# EAGLE design LTC2473CDR1 (EAGLE 9.6.2)
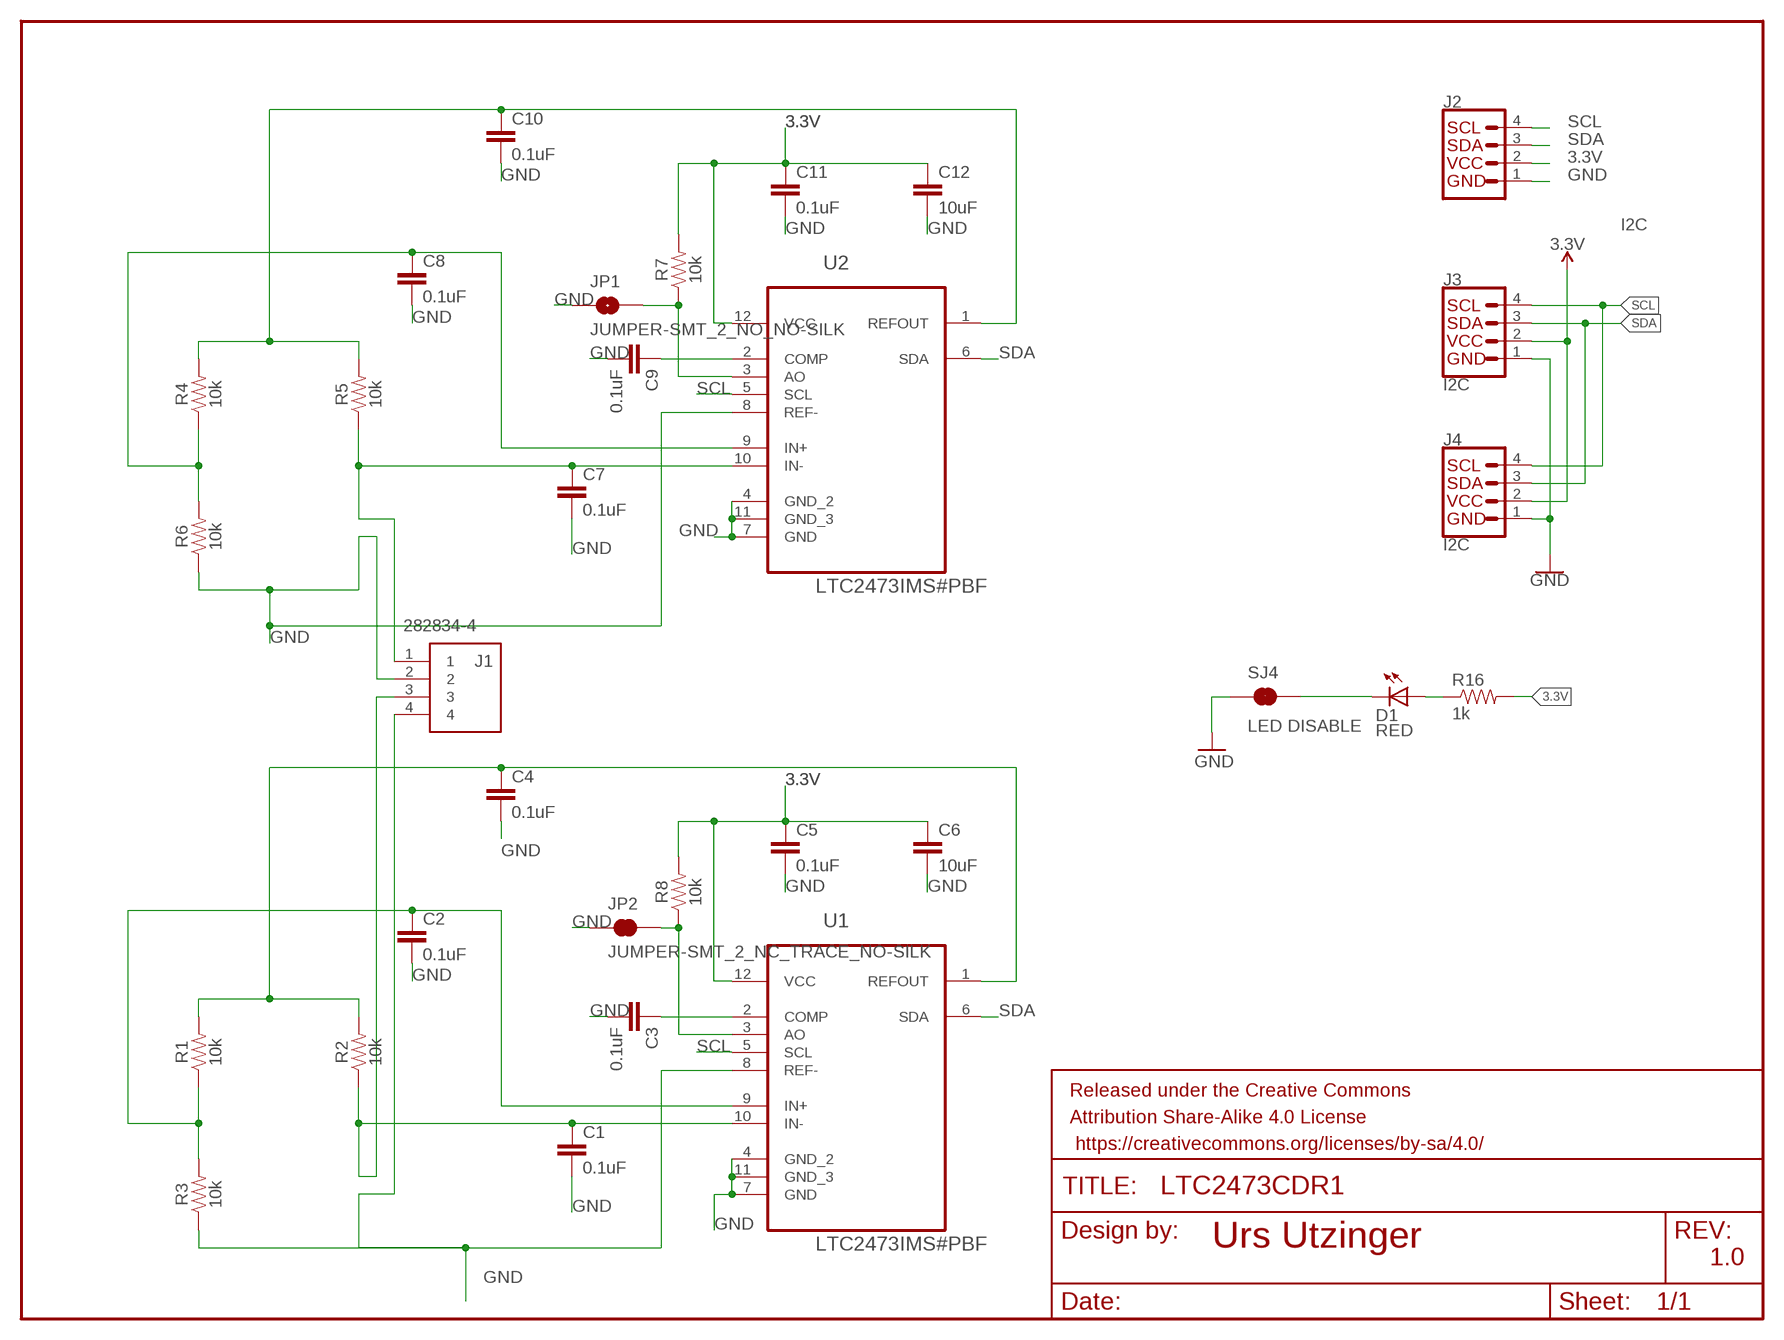
[diagram p0: schematic, sheet 1]

## Parts
C1  0.1uF  0.1UF-0603-25V-(+80/-20%)  [0603]
C2  0.1uF  0.1UF-0603-25V-(+80/-20%)  [0603]
C3  0.1uF  0.1UF-0603-25V-(+80/-20%)  [0603]
C4  0.1uF  0.1UF-0603-25V-(+80/-20%)  [0603]
C5  0.1uF  0.1UF-0603-25V-(+80/-20%)  [0603]
C6  10uF  10UF-0603-6.3V-20%  [0603]
C7  0.1uF  0.1UF-0603-25V-(+80/-20%)  [0603]
C8  0.1uF  0.1UF-0603-25V-(+80/-20%)  [0603]
C9  0.1uF  0.1UF-0603-25V-(+80/-20%)  [0603]
C10  0.1uF  0.1UF-0603-25V-(+80/-20%)  [0603]
C11  0.1uF  0.1UF-0603-25V-(+80/-20%)  [0603]
C12  10uF  10UF-0603-6.3V-20%  [0603]
D1  RED  LED-RED0603  [LED-0603]
FRAME1  FRAME-LETTERNO_PACKAGE  [DUMMY]
J1  282834-4  [2828344]
J2  I2C  I2C_STANDARD  [1X04]
J3  I2C  QWIIC_CONNECTORJS-1MM  [JST04_1MM_RA]
J4  I2C  QWIIC_CONNECTORJS-1MM  [JST04_1MM_RA]
JP1  JUMPER-SMT_2_NO_NO-SILK  [SMT-JUMPER_2_NO_NO-SILK]
JP2  JUMPER-SMT_2_NC_TRACE_NO-SILK  [SMT-JUMPER_2_NC_TRACE_NO-SILK]
R1  10k  10KOHM-0603-1/10W-1%  [0603]
R2  10k  10KOHM-0603-1/10W-1%  [0603]
R3  10k  10KOHM-0603-1/10W-1%  [0603]
R4  10k  10KOHM-0603-1/10W-1%  [0603]
R5  10k  10KOHM-0603-1/10W-1%  [0603]
R6  10k  10KOHM-0603-1/10W-1%  [0603]
R7  10k  10KOHM-0603-1/10W-1%  [0603]
R8  10k  10KOHM-0603-1/10W-1%  [0603]
R16  1k  1KOHM-0603-1/10W-1%  [0603]
SJ4  LED DISABLE  JUMPER-SMT_2_NC_TRACE_NO-SILK  [SMT-JUMPER_2_NC_TRACE_NO-SILK]
U1  LTC2473IMS#PBF  [SOP65P490X110-12N]
U2  LTC2473IMS#PBF  [SOP65P490X110-12N]

## Nets
3.3V: C5.1 C6.1 C11.1 C12.1 J2.2 J3.2 J4.2 R7.2 R8.2 R16.2 U1.12(VCC) U2.12(VCC)
GND: C1.2 C2.2 C3.2 C4.2 C5.2 C6.2 C7.2 C8.2 C9.2 C10.2 C11.2 C12.2 J1.2 J1.4 J2.1 J3.1 J4.1 JP1.1 JP2.1 R3.1 R6.1 SJ4.1 U1.4(GND_2) U1.7(GND) U1.8(REF-) U1.11(GND_3) U2.4(GND_2) U2.7(GND) U2.8(REF-) U2.11(GND_3)
N$1: C3.1 U1.2(COMP)
N$2: C2.1 R1.1 R3.2 U1.9(IN+)
N$3: C8.1 R4.1 R6.2 U2.9(IN+)
N$4: C4.1 R1.2 R2.2 U1.1(REFOUT)
N$5: JP1.2 R7.1 U2.3(AO)
N$6: D1.A R16.1
N$8: C7.1 J1.1 R5.1 U2.10(IN-)
N$9: C10.1 R4.2 R5.2 U2.1(REFOUT)
N$10: D1.C SJ4.2
N$11: C9.1 U2.2(COMP)
N$12: C1.1 J1.3 R2.1 U1.10(IN-)
N$13: JP2.2 R8.1 U1.3(AO)
SCL: J2.4 J3.4 J4.4 U1.5(SCL) U2.5(SCL)
SDA: J2.3 J3.3 J4.3 U1.6(SDA) U2.6(SDA)

## Notes on the sheet
- Urs Utzinger
- 1.0

## Library data of the parts
C1-C5 C7-C11 = SparkFun-Capacitors:0.1UF: 0.1µF ceramic capacitors A capacitor is a passive two-terminal electrical component used to store electrical energy temporarily in an electric field.; PROD_ID: CAP-00810
C6 C12 = SparkFun-Capacitors:10UF: 10.0µF ceramic capacitors A capacitor is a passive two-terminal electrical component used to store electrical energy temporarily in an electric field.; PROD_ID: CAP-11015
D1 = SparkFun-LED:LED-RED: Assorted Red LEDs LilyPad 1206- DIO-09912 1206- DIO-00809 0603- DIO-00819; PROD_ID: DIO-00819
FRAME1 = SparkFun-Aesthetics:FRAME-LETTER: Schematic Frame - Letter Standard 8.5x11 US Letter frame; DESIGNER: Nobody; VERSION: v01
J1 = SamacSys_Parts:282834-4: ic Source: Datasheet <https://www.te.com/commerce/DocumentDelivery/DDEController?Action=srchrtrv&DocNm=282834&DocType=Customer Drawing&DocLang=English&PartCntxt=282834-4&DocFormat=pdf>; DESCRIPTION: ic; HEIGHT: 10.3mm; MANUFACTURER_NAME: TE Connectivity; MANUFACTURER_PART_NUMBER: 282834-4; MOUSER_PART_NUMBER: 571-282834-4; MOUSER_PRICE-STOCK: https://www.mouser.co.uk/ProductDetail/TE-Connectivity/282834-4?qs=A%252Bip%252BNCYi6Pqom9P%2FaHyRQ%3D%3D
J2 = SparkFun-Connectors:I2C_STANDARD: SparkFun I2C Standard Pinout Header SparkFun has standardized on a pinout for all I2C based sensor breakouts. This pinout allows I2C boards to be plugged directly into the headers on Arduino Uno compatible boards, and to be daisy chained easily. Example SparkFun Products: SparkFun Atmospheric Sensor Breakout - BME280 <https://www.sparkfun.com/products/13676> SparkFun Altitude/Pressure Sensor Breakout - MPL3115A2 <https://www.sparkfun.com/products/11084> SparkFun TOF Range Finder Sensor - VL6180 <https://www.sparkfun.com/products/12785>
J3 J4 = SparkFun-Connectors:QWIIC_CONNECTOR: SparkFun I2C Standard Qwiic Connector An SMD 1mm pitch JST connector makes it easy and quick (get it? Qwiic?) to connect I2C devices to each other. The Qwiic system <http://www.sparkfun.com/qwiic> enables fast and solderless connection between popular platforms and various sensors and actuators. We carry 200mm <https://www.sparkfun.com/products/14204>, 100mm <https://www.sparkfun.com/products/14205>, 50mm <https://www.sparkfun.com/products/14206>, and breadboard friendly <https://www.sparkfun.com/products/14207> Qwiic cables. We also offer 10 pcs strips <https://www.sparkfun.com/products/14323> the SMD connectors.; PROD_ID: CONN-13694
JP1 = SparkFun-Jumpers:JUMPER-SMT_2_NO: Normally open jumper This jumper has two pads in close proximity to each other. Apply solder to close the connection. Round pads are easier to solder for beginners, but are a lot larger. SparkFun Product that uses the round pads: SparkFun EL Sequencer <https://www.sparkfun.com/products/12781>
JP2 SJ4 = SparkFun-Jumpers:JUMPER-SMT_2_NC_TRACE: Normally closed trace jumper This jumper has a trace between two pads so it's normally closed (NC). Use a razor knife to open the connection. For best results follow the IPC guidelines for cutting traces: Cutout at least 0.063 mm (0.005 in). Remove all loose material to clean up the cut area. Seal the cut with an approved epoxy. Reapply solder to reclose the connection.
R1-R8 = SparkFun-Resistors:10KOHM: 10kΩ resistor A resistor is a passive two-terminal electrical component that implements electrical resistance as a circuit element. Resistors act to reduce current flow, and, at the same time, act to lower voltage levels within circuits. - Wikipedia; PROD_ID: RES-00824
R16 = SparkFun-Resistors:1KOHM: 1kΩ resistor A resistor is a passive two-terminal electrical component that implements electrical resistance as a circuit element. Resistors act to reduce current flow, and, at the same time, act to lower voltage levels within circuits. - Wikipedia; PROD_ID: RES-07856
U1 U2 = LTC2473IMS_PBF:LTC2473IMS#PBF: ADC Check availability <https://pricing.snapeda.com/parts/LTC2473IMS%23PBF/Analog%20Devices/view-part?ref=eda>; AVAILABILITY: In Stock; DESCRIPTION: Selectable 208sps/833sps, 16-Bit I2C ΔΣ ADCs with 10ppm/°C Max Precision Reference; MF: Analog Devices; MP: LTC2473IMS#PBF; PACKAGE: MSOP-12 Analog Devices; PRICE: None; PURCHASE-URL: https://pricing.snapeda.com/search/part/LTC2473IMS#PBF/?ref=eda

## Net classes
0 default: clearance 0.205 mm

## Board
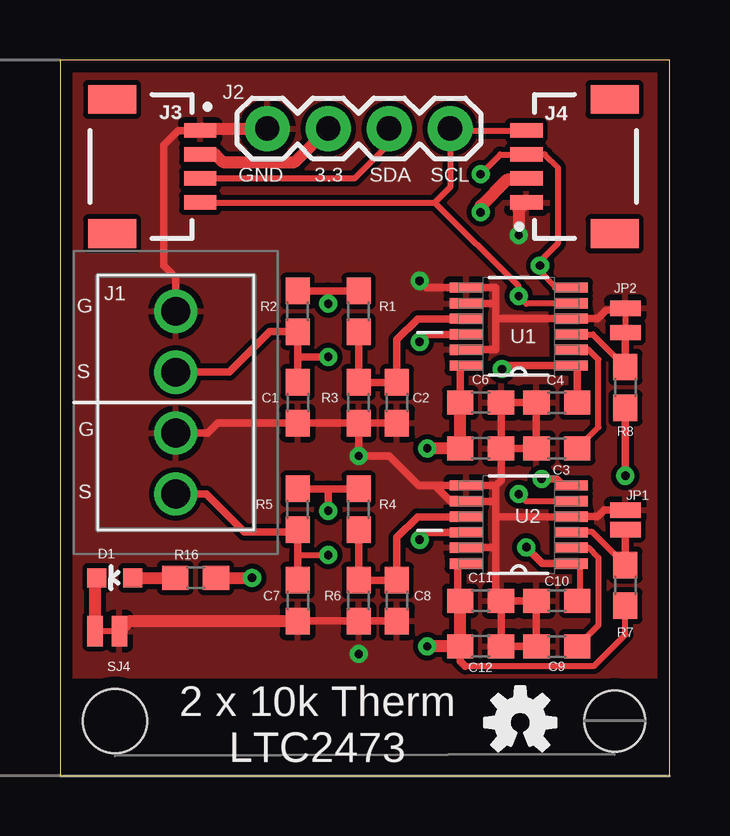
[diagram p1: board, top side]
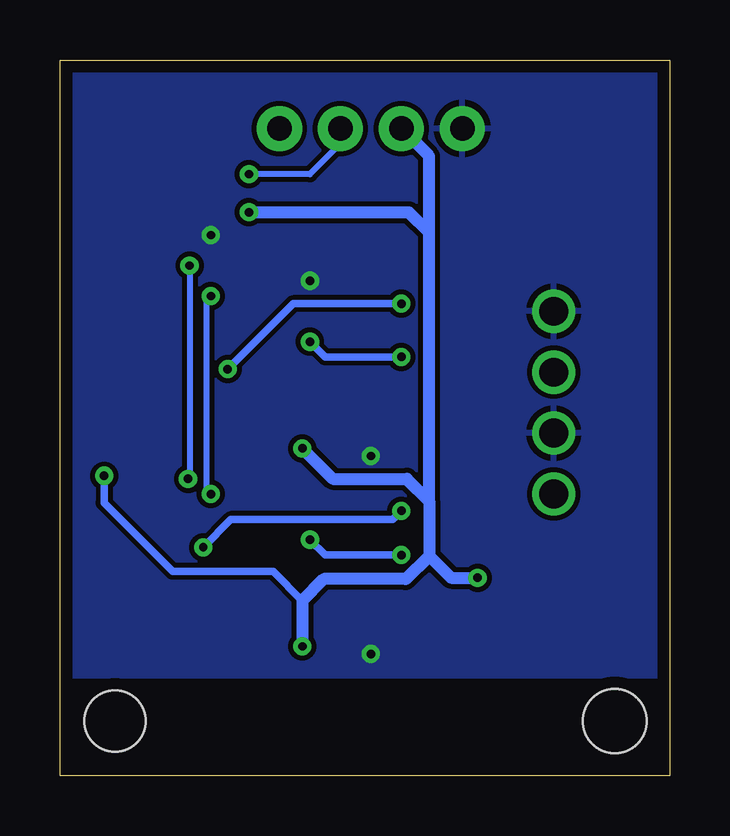
[diagram p2: board, bottom side, seen from below]

Size 25.4 x 29.84 mm. Coordinates in mm from the lower left corner, seen from the top.
Outline: 0,0 25.4,0 25.4,29.84 0,29.84 0,0
Copper layers (1*16): Top 0.035mm / dielectric 1.5mm / Bottom 0.035mm
Design rules "default *": minimum track width 6mil, minimum drill 0.35mm, track to track 6mil, track to pad 6mil, pad to pad 6mil, via to via 6mil, smd to smd 6mil, copper to edge 20mil, drill to drill 6mil, minimum pad ring 10mil, minimum via ring 8mil, stop-mask expansion 4mil, vias tented up to drill 0mil, thermal gap 10mil
Holes 2.67 mm at 2.29,2.29
Holes 2.54 mm at 23.11,2.29

### Footprints (pad centres in the part's own frame; a part is rotated, then mirrored left to right if it is on the bottom)
0603 = smd 1.1 x 1: 1 -0.85,0; 2 0.85,0
LED-0603 = smd 0.8 x 0.8: A 0,-0.75; C 0,0.75
2828344 = drill 1.2 pad 1.8: 1 0,0; 2 2.54,0; 3 5.08,0; 4 7.62,0
1X04 = drill 1.016 pad 1.88: 1 0,0; 2 2.54,0; 3 5.08,0; 4 7.62,0
JST04_1MM_RA = smd 0.6 x 1.35: 1 -1.5,0; 2 -0.5,0; 3 0.5,0; 4 1.5,0 | smd 1.2 x 2: NC1 2.8,-3.675; NC2 -2.8,-3.675
SMT-JUMPER_2_NO_NO-SILK = smd 0.635 x 1.27: 1 -0.406,0; 2 0.406,0
SMT-JUMPER_2_NC_TRACE_NO-SILK = smd 0.635 x 1.27: 1 -0.508,0; 2 0.508,0
SOP65P490X110-12N = smd 1.397 x 0.432: 1 -2.184,1.626; 2 -2.184,0.965; 3 -2.184,0.33; 4 -2.184,-0.33; 5 -2.184,-0.965; 6 -2.184,-1.626; 7 2.184,-1.626; 8 2.184,-0.965; 9 2.184,-0.33; 10 2.184,0.33; 11 2.184,0.965; 12 2.184,1.626

### Placement (x,y rotation side)
C1  9.91,15.56 270 top
C2  14.03,15.56 270 top
C3  20.7,13.65 180 top
C4  20.7,15.56 180 top
C5  17.53,13.65 0 top
C6  17.53,15.56 0 top
C7  9.91,7.3 270 top
C8  14.03,7.3 270 top
C9  20.7,5.4 180 top
C10  20.7,7.3 180 top
C11  17.53,7.3 0 top
C12  17.53,5.4 0 top
D1  2.29,8.26 90 top
FRAME1  -1.02,-0.51 0 top
J1  4.83,11.75 90 top
J2  8.64,26.99 0 top
J3  5.84,25.4 270 top
J4  19.43,25.4 90 top
JP1  23.56,10.67 270 top
JP2  23.56,18.99 270 top
R1  12.45,19.37 90 top
R2  9.91,19.37 90 top
R3  12.45,15.56 90 top
R4  12.45,11.11 90 top
R5  9.91,11.11 90 top
R6  12.45,7.3 90 top
R7  23.56,7.94 270 top
R8  23.56,16.19 270 top
R16  5.65,8.26 0 top
SJ4  1.97,6.03 180 top
U1  19.11,18.73 180 top
U2  19.11,10.48 180 top
U$1  [OSHW-LOGO-S]  19.18,2.22 0 top

### Tracks (layer width: path | path; a pad name or v marks a point on that pad's centre or on a via)
3.3V  (via drill 0.35)
  Top 0.254: R7.2 23.56,5.88 22.24,4.57 16.89,4.57 | J4.2 19.38,24.85 | U2.12 16.57,8.85
  Top 0.305: U1.12 16.68,17.11 C6.1 | R8.2 v23.56,12.51 | C11.1 16.57,7.3 16.57,8.85 | 16.89,4.57 16.68,4.78 C12.1
  Top 0.508: C6.1 C5.1 v15.3,13.65 | v15.3,5.4 C12.1 C11.1 | R16.2 v8,8.26 | J3.2 6.47,25.9 6.79,25.59 9.78,25.59 J2.2 | 19.38,24.85 18.62,24.85 17.53,23.76 v17.53,23.5
  Bottom 0.305: 15.3,7.3 16.52,8.52 20.7,8.52 23.56,11.38 v23.56,12.51
  Bottom 0.508: v15.3,13.65 14.03,12.38 10.95,12.38 10.02,11.46 | 10.02,11.46 10.02,9.18 | 10.02,9.18 10.99,8.21 14.4,8.21 15.3,7.3 v15.3,5.4 | 10.02,9.18 9.1,8.26 v8,8.26 | 10.02,11.46 10.02,22.66 | 10.02,22.66 10.86,23.5 v17.53,23.5 | 10.02,22.66 10.02,25.83 J2.2
GND  (via drill 0.35)
  Top 0.152: 19.9,14.04 19.85,14.02 C3.2 | 12.74,14.64 R3.1 | J3.1 5.93,26.99
  Top 0.254: 19.85,5.71 19.85,5.29 | 18.48,5.4 C12.2
  Top 0.305: R3.1 C1.2 6.58,14.71 6.16,14.29 J1.2 | R3.1 C2.2 | R3.1 v12.45,13.34 13.72,13.34 14.95,12.1 15.62,12.1 | U1.8 16.93,19.68 18.16,19.68 | 18.16,19.68 18.16,19.06 | U1.11 18.16,17.77 18.16,19.06 | 18.16,19.68 18.16,20.36 U1.7 15.27,20.36 v14.99,20.64 | C5.2 C6.2 C4.2 C3.2 C5.2 | 18.16,12.1 U2.7 15.62,12.1 | 18.16,12.1 18.16,11.43 | U2.11 18.16,9.51 | C8.2 R6.1 C7.2 | C11.2 C12.2 C9.2 | C11.2 C10.2 19.85,5.71 | 18.16,11.43 18.16,10.79 | 18.16,9.51 18.16,10.79 | 18.16,19.06 U1.4 22.4,19.06 22.73,19.39 JP2.1 | C11.2 18.16,7.52 18.16,9.51 | C5.2 18.38,12.32 18.16,12.1 | 18.16,10.79 21.29,10.79 U2.4 22.4,10.81 22.67,11.07 JP1.1 | 15.62,12.1 16.28,11.44 U2.8 16.94,11.43 18.16,11.43 | J1.4 4.83,20.77 4.32,21.27 4.32,26.29 4.93,26.9 J3.1
  Top 0.508: 18.48,7.3 C11.2 | 5.93,26.99 J2.1 | J4.1 19.11,23.58 v19.11,22.54 | SJ4.1 2.9,6.45 C7.2
  other vias: 12.45,5.08
  pour Bottom: 0,29.84 0,4.13 25.4,4.13 25.4,29.84
  pour Top: 25.4,29.84 25.4,4.13 0,4.13 0,29.84
N$1
  Top 0.254: 21.67,17.78 22.01,17.78 22.43,17.36 22.43,14.53 C3.1
  Top 0.305: U1.2 21.65,17.77 21.67,17.78
N$2
  Top 0.305: R1.1 R3.2 C2.1 14.03,18.18 14.9,19.05 16.92,19.05 U1.9
N$3
  Top 0.305: R4.1 R6.2 C8.1 14.03,9.93 14.9,10.79 16.92,10.79 U2.9
N$4  (via drill 0.35)
  Top 0.305: R2.2 11.18,20.22 | 11.18,20.22 R1.2 | C4.1 21.55,17.11 U1.1 18.57,17.11 v18.41,16.95 | 11.18,20.22 v11.18,19.68
  Bottom 0.305: v11.18,19.68 15.68,19.68 v18.41,16.95
N$5
  Top 0.254: R7.1 22.19,10.16 U2.3
  Top 0.305: R7.1 JP1.2 | U2.3
N$6
  Top 0.508: D1.A R16.1
N$8  (via drill 0.35)
  Top 0.254: 9.91,9.21 v11.18,9.21
  Top 0.305: R5.1 9.91,10.16 | 9.91,10.16 9.91,9.21 C7.1 | 9.91,10.16 7.68,10.16 6.1,11.75 J1.1 | U2.10 15.29,10.15 v14.99,9.84
  Bottom 0.305: v11.18,9.21 14.35,9.21 v14.99,9.84
N$9  (via drill 0.35)
  Top 0.254: U2.1 21.65,8.85 21.65,7.3 C10.1
  Top 0.305: R5.2 11.18,11.96 | 11.18,11.96 R4.2 | 11.18,11.96 v11.18,11.05 | U2.1 20.1,8.85 v19.43,9.53
  Bottom 0.305: v19.43,9.53 18.28,10.68 11.54,10.68 v11.18,11.05
N$10
  Top 0.508: SJ4.2 1.46,8.18 D1.C
N$11
  Top 0.254: U2.2 22.02,9.51 22.43,9.1 22.43,6.28 C9.1
N$12  (via drill 0.35)
  Top 0.305: J1.3 7.05,16.83 8.74,18.52 R2.1 9.91,17.46 | 9.91,17.46 C1.1 | 9.91,17.46 v11.18,17.46 | U1.10 15.29,18.4 v14.99,18.1
  Bottom 0.305: v14.99,18.1 14.35,17.46 v11.18,17.46
N$13
  Top 0.254: U1.3 22.2,18.4 R8.1
  Top 0.305: R8.1 JP2.2
SCL  (via drill 0.35)
  Top 0.152: J2.4 16.34,26.9
  Top 0.254: 21.3,19.79 U1.5 21.29,19.68 19.43,19.68 v19.11,20 19.11,20.41 15.62,23.9 | U2.5 19.42,11.44 v19.11,11.75 | 21.34,19.7 21.34,19.79 | J3.4 15.62,23.9 | 16.34,26.9 J4.4 | 15.62,23.9 16.28,24.55 16.28,26.97 J2.4
  Top 0.305: 21.34,19.68 21.34,19.7 U1.5 | U2.5
  Bottom 0.254: v19.11,11.75 19.32,11.95 19.32,19.8 v19.11,20
SDA  (via drill 0.35)
  Top 0.254: 20.66,20.36 20,21.02 v20,21.27 20,21.46 20.76,22.22 20.76,25.35 20.2,25.9 J4.3 18.34,25.9 v17.53,25.08 | J2.3 13.72,26.35 12.26,24.9 J3.3
  Top 0.305: U1.6 20.66,20.36 | v20.07,12.38 20.7,12.38 21.02,12.06 21.34,12.06 21.34,12.1 U2.6
  Bottom 0.254: v20,21.27 20,12.45 v20.07,12.38 | J2.3 13.72,26.35 14.99,25.08 v17.53,25.08

### Text on the board
tPlace: GND | 3.3 | SDA | SCL | G | S | G | S | 2 x 10k Therm / LTC2473